# EAGLE design usbBBO (EAGLE 8.0.1)
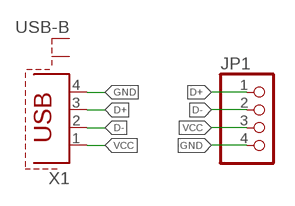
[diagram p0: schematic, sheet 1]

## Parts
JP1  PINHD-1X4  [1X04]
X1  USB-B  [USB-B]

## Nets
D+: JP1.1 X1.3
D-: JP1.2 X1.2
GND: JP1.4 X1.4
VCC: JP1.3 X1.1
Unconnected: X1.S1 X1.S2

## Library data of the parts
JP1 = pinhead:PINHD-1X4: PIN HEADER
X1 = myLib:USB-B

## Board
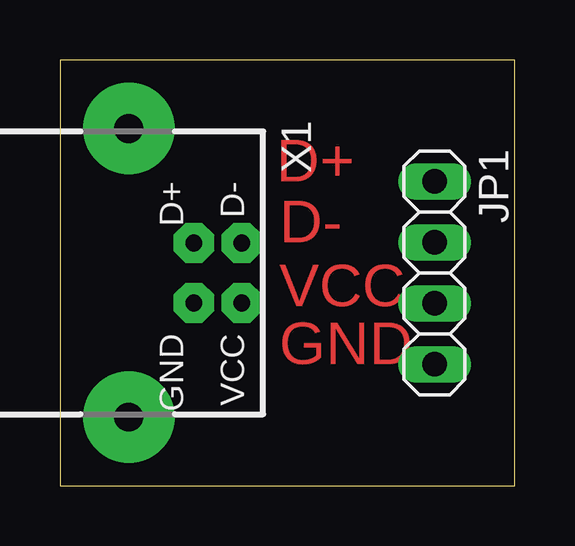
[diagram p1: board, top side]
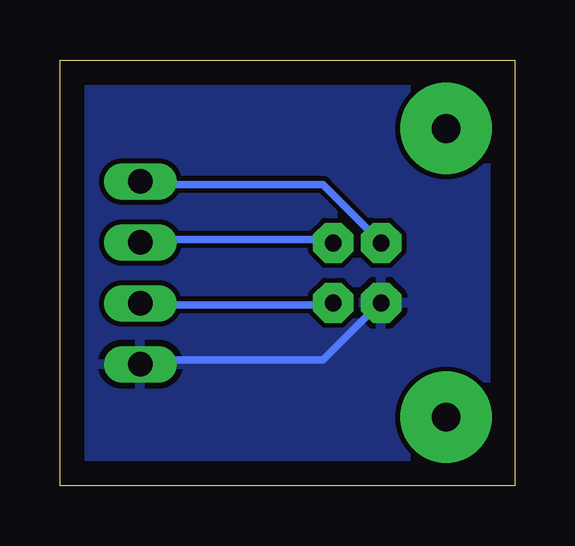
[diagram p2: board, bottom side, seen from below]

Size 18.97 x 17.77 mm. Coordinates in mm from the lower left corner, seen from the top.
Outline: 0,0 18.97,0 18.97,17.77 0,17.77 0,0
Copper layers (1*16): Top 0.035mm / dielectric 1.5mm / Bottom 0.035mm
Design rules "default": minimum track width 10mil, minimum drill 24mil, track to track 8mil, track to pad 8mil, pad to pad 8mil, via to via 8mil, smd to smd 8mil, copper to edge 40mil, drill to drill 8mil, minimum pad ring 10mil, minimum via ring 8mil, stop-mask expansion 4mil, vias tented up to drill 0mil, thermal gap 10mil

### Footprints (pad centres in the part's own frame; a part is rotated, then mirrored left to right if it is on the bottom)
1X04 = drill 1.016 long: 1 -3.81,0; 2 -1.27,0; 3 1.27,0; 4 3.81,0
USB-B = drill 0.7 pad 1.676 octagon: 1 1.25,5.98; 2 -1.25,5.98; 3 -1.25,3.98; 4 1.25,3.98 | drill 1.2 pad 3.81: S1 -6.02,1.27; S2 6.02,1.27

### Placement (x,y rotation side)
JP1  15.62,8.89 270 top
X1  1.6,8.89 270 top

### Tracks (layer width: path | path; a pad name or v marks a point on that pad's centre or on a via)
D+
  Bottom 0.305: JP1.1 15.54,12.57 8,12.57 5.71,10.29 X1.3
D-
  Bottom 0.305: JP1.2 15.54,10.29 7.77,10.29 X1.2
GND
  Bottom 0.305: JP1.4 15.54,5.26 8,5.26 5.71,7.54 X1.4
  pour Bottom: 0,0 0,17.78 19.05,17.78 19.05,0
VCC
  Bottom 0.305: JP1.3 15.54,7.54 7.77,7.54 X1.1

### Text on the board
Top: D+ | D- | VCC | GND